# Altium project Yukitora.PrjPcb (part 5 of 5)

## Sheet ZPZH.SchDoc
size OrCAD A; Organization: Altium Limited; Address1: L3, 12a Rodborough Rd; Address2: Frenchs Forest; Address3: NSW; Address4: Australia 2086
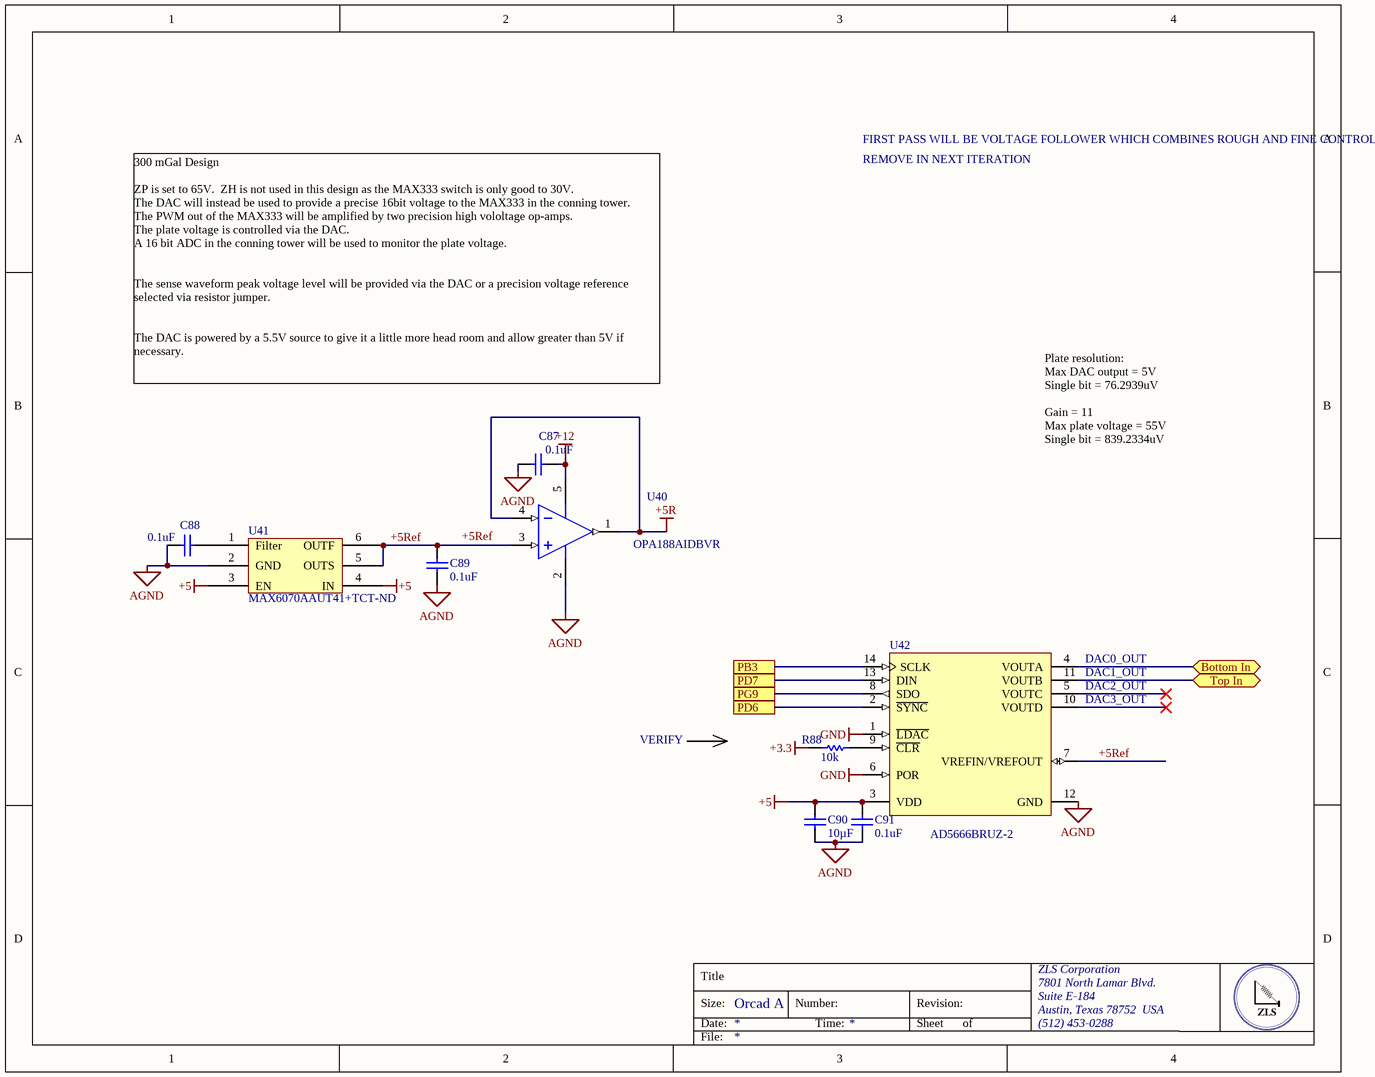
[diagram p12: ZPZH.SchDoc]

### Parts
C87  0.1uF  [CAPC0402(1005)60_L]
C88  0.1uF  [CAPC0402(1005)60_L]
C89  0.1uF  [CAPC0402(1005)60_L]
C90  Capacitance: 10µF  [CAPC0805(2012)145_N]  (hidden comment: 10uF)
C91  0.1uF  [CAPC0402(1005)60_L]
R88  10k  [RESC0402(1005)_M]
U40  OPA188AIDBVR  [DBV0005A_M]
U41  Supplier Part Number 1: MAX6070AAUT41+TCT-ND  [SOT95P280X445-6N]  (hidden comment: MAX6070AAUT41+T)
U42  AD5666BRUZ-2  [RU-14_N]

### Ports
Bottom In (bidir), PB3, PD6, PD7, PG9, Top In (bidir)

### Nets
+3.3: R88.1
+5: C90.2 C91.1 U41.3(EN) U41.4(IN) U42.3(VDD)
+5R: U40.1(OUT) U40.4(IN-)
+12: C87.1 U40.5(V+)
AGND: C87.2 C88.2 C89.1 C90.1 C91.2 U40.2(V-) U41.2(GND) U42.12(GND)
GND: U42.1(~{LDAC}) U42.6(POR)
+5Ref: C89.2 U40.3(IN+) U41.5(OUTS) U41.6(OUTF) U42.7(VREFIN/VREFOUT)
Bottom In: U42.4(VOUTA) ; port Bottom In
PB3: U42.14(SCLK) ; port PB3
PD6: U42.2(~{SYNC}) ; port PD6
PD7: U42.13(DIN) ; port PD7
PG9: U42.8(SDO) ; port PG9
Top In: U42.11(VOUTB) ; port Top In
NetC88_1: C88.1 U41.1(Filter)
NetR88_2: R88.2 U42.9(~{CLR})

Not connected (* = marked no-connect by the designer): U42 5(VOUTC)* 10(VOUTD)*

### Notes on the sheet
- FIRST PASS WILL BE VOLTAGE FOLLOWER WHICH COMBINES ROUGH AND FINE CONTROL
- REMOVE IN NEXT ITERATION
- 300 mGal Design
  ZP is set to 65V.  ZH is not used in this design as the MAX333 switch is only good to 30V.
  The DAC will instead be used to provide a precise 16bit voltage to the MAX333 in the conning tower.
  The PWM out of the MAX333 will be amplified by two precision high vololtage op-amps.
  The plate voltage is controlled via the DAC.
  A 16 bit ADC in the conning tower will be used to monitor the plate voltage.
  The sense waveform peak voltage level will be provided via the DAC or a precision voltage reference selected via resistor jumper.
  The DAC is powered by a 5.5V source to give it a little more head room and allow greater than 5V if necessary.
- Plate resolution:
  Max DAC output = 5V
  Single bit = 76.2939uV
  Gain = 11
  Max plate voltage = 55V
  Single bit = 839.2334uV
- (near U42) DAC0_OUT
- (near U42) DAC1_OUT
- (near U42) DAC2_OUT
- VERIFY
- (near U42) DAC3_OUT
- Labels drawn without touching a wire or pin: +5Ref
- Title
- Size:
- Date:
- Orcad A
- Number:
- Time:
- Revision:
- Sheet
- of
- ZLS Corporation
- 7801 North Lamar Blvd.
- Suite E-184
- Austin, Texas 78752  USA
- (512) 453-0288
- File:

### Library data of the parts
C87-C89 C91 = CMP-1034-00252-1: CAP CER 0.1UF 10V X7R 0402; Manufacturer: Murata Electronics North America; Manufacturer Part Number: GRM155R71A104KA01D; Tolerance: ±10%; Supplier 1: Digi-Key; Supplier Part Number 1: 490-6321-1-ND; RoHS: RoHS Compliant; Category: Capacitors; Stock 1: 2920395; Pricing 1: 1=0.1, 10=0.014, 100=0.0063, 500=0.00446, 1000=0.00351, 2500=0.00319, 5000=0.00293 (USD); Packaging: Cut Tape (CT); Part Status: Active; Voltage - Rated: 10V; Temperature Coefficient: X7R; Operating Temperature: -55°C ~ 125°C; Features: -; Ratings: -; Applications: General Purpose; Mounting Type: Surface Mount, MLCC; Package / Case: 0402 (1005 Metric); Size / Dimension: 0.039" L x 0.020" W (1.00mm x 0.50mm); Height - Seated (Max): -; Thickness (Max): 0.022" (0.55mm); Lead Spacing: -; ComponentLink1URL: http://www.murata.com/~/media/webrenewal/support/library/catalog/products/capacitor/mlcc/c02e.ashx?la=en-us; ComponentLink1Description: http://www.murata.com/~/media/webrenewal/support/library/catalog/products/capacitor/mlcc/c02e.ashx?la=en-us
C90 = CMP-1036-04795-1: CAP CER 10UF 25V X7R 0805; Manufacturer: Murata Electronics North America; Manufacturer Part Number: GRM21BR71E104KA01L; Tolerance: ±10%; Supplier 1: Digi-Key; Supplier Part Number 1: 490-1673-6-ND; RoHS: RoHS Compliant; Category: Capacitors; Stock 1: 891652; Pricing 1: 1=0.2, 10=0.145, 100=0.0683, 500=0.04788, 1000=0.03964 (USD); Packaging: Digi-Reel®; Part Status: Active; Voltage - Rated: 25V; Temperature Coefficient: X7R; Operating Temperature: -55°C ~ 125°C; Features: -; Ratings: -; Applications: General Purpose; Mounting Type: Surface Mount, MLCC; Package / Case: 0805 (2012 Metric); Size / Dimension: 0.079" L x 0.049" W (2.00mm x 1.25mm); Height - Seated (Max): -; Thickness (Max): 0.053" (1.35mm); Lead Spacing: -; Lead Style: -; ComponentLink1URL: http://www.murata.com/~/media/webrenewal/support/library/catalog/products/capacitor/mlcc/c02e.ashx; ComponentLink1Description: http://www.murata.com/~/media/webrenewal/support/library/catalog/products/capacitor/mlcc/c02e.ashx
R88 = CMP-1011-00940-1: 10k 0.063W 1% 0402 (1005 Metric)  SMD; Manufacturer: Panasonic; Manufacturer Part Number: ERJ-2RKF1002X; Resistance: 10kR; Temperature Coefficient: 100ppm/°C; Power Rating: 100mW; Voltage Rating: 50V; Supplier 1: Digi-Key; Supplier Part Number 1: P10.0KLDKR-ND; Stock 1: 12501303; Pricing 1: 1=0.10000, 10=0.04500, 100=0.01830, 1000=0.00823, 2500=0.00715, 5000=0.00590 (USD); RoHS: Yes; Mount: Surface Mount; Case/Package: 0402; Number of Pins: 2; Case Code (Metric): 1005; Case Code (Imperial): 0402; Contact Plating: Tin; Min Operating Temperature: -55°C; Max Operating Temperature: 155°C; Tolerance: 1%; Packaging: Tape and Reel; Composition: Thick Film; Termination: SMD/SMT; Voltage Rating (DC): 50V; Package Quantity: 1; Number of Terminations: 2; Max Power Dissipation: 100mW; Military Standard: Not; Features: Automotive AEC-Q200; Length: 1mm; Height: 0.35mm; Width: 0.02inch; Depth: 0.5mm; Radiation Hardening: No; Lead Free: Lead Free; REACH SVHC: No SVHC; ComponentLink1URL: https://datasheet.ciiva.com/11821/0900766b80f80784-11821171.pdf?src-supplier=RSComponents; ComponentLink1Description: https://datasheet.ciiva.com/11821/0900766b80f80784-11821171.pdf?src-supplier=RSComponents; ComponentLink2URL: https://datasheet.ciiva.com/16199/aoa0000ce2-16199478.pdf?src-supplier=Future+Electronics; ComponentLink2Description: https://datasheet.ciiva.com/16199/aoa0000ce2-16199478.pdf?src-supplier=Future+Electronics; ComponentLink3URL: https://datasheet.ciiva.com/17212/aoa0000ce2-17212102.pdf?src-supplier=Avnet+Europe; ComponentLink3Description: https://datasheet.ciiva.com/17212/aoa0000ce2-17212102.pdf?src-supplier=Avnet+Europe; ComponentLink4URL: https://datasheet.ciiva.com/24023/aoa0000ce2-24023017.pdf?src-supplier=Mouser; ComponentLink4Description: https://datasheet.ciiva.com/24023/aoa0000ce2-24023017.pdf?src-supplier=Mouser; ComponentLink5URL: https://datasheet.ciiva.com/28514/1678782-28514185.pdf?src-supplier=Element14; ComponentLink5Description: https://datasheet.ciiva.com/28514/1678782-28514185.pdf?src-supplier=Element14; ComponentLink6URL: https://datasheet.ciiva.com/43467/1678782-43467402.pdf?src-supplier=Farnell; ComponentLink6Description: https://datasheet.ciiva.com/43467/1678782-43467402.pdf?src-supplier=Farnell; ComponentLink7URL: https://datasheet.ciiva.com/27055/1987020-27055643.pdf?src-supplier=Jameco; ComponentLink7Description: https://datasheet.ciiva.com/27055/1987020-27055643.pdf?src-supplier=Jameco; ComponentLink8URL: https://datasheet.ciiva.com/48531/aoa0000ce2-48531069.pdf?src-supplier=Avnet; ComponentLink8Description: https://datasheet.ciiva.com/48531/aoa0000ce2-48531069.pdf?src-supplier=Avnet; ComponentLink9URL: https://datasheet.ciiva.com/9194/aoa0000ce2-9194142.pdf?src-supplier=Avnet; ComponentLink9Description: https://datasheet.ciiva.com/9194/aoa0000ce2-9194142.pdf?src-supplier=Avnet; ComponentLink10URL: https://datasheet.ciiva.com/16782/70260748-16782590.pdf?src-supplier=Allied+Electronics; ComponentLink10Description: https://datasheet.ciiva.com/16782/70260748-16782590.pdf?src-supplier=Allied+Electronics; ComponentLink11URL: https://datasheet.ciiva.com/16786/70260748-16786734.pdf?src-supplier=Allied+Electronics; ComponentLink11Description: https://datasheet.ciiva.com/16786/70260748-16786734.pdf?src-supplier=Allied+Electronics; ComponentLink12URL: https://datasheet.ciiva.com/30201/aoa0000ce2-30201022.pdf?src-supplier=Onlinecomponents.com; ComponentLink12Description: https://datasheet.ciiva.com/30201/aoa0000ce2-30201022.pdf?src-supplier=Onlinecomponents.com
U40 = CMP-0809-00005-2: Precision, Low Noise, Rail-to-Rail Output, Zero-Drift Operational Amplifier, 4 to 36 V, -40 to 125 degC, 5-pin SOT23 (DBV5), Green (RoHS & no Sb/Br); Manufacturer: Texas Instruments; Total Supply Voltage(Min)(+5V is 5, +/-5V is 10): 4; Offset Drift(Typ)(uV/C): 0.03; Rating: Catalog; SubFamily: Zero Drift Precision Amplifier; GBW(Typ)(MHz): 2; Slew Rate(Typ)(V/us): 0.8; Number of Channels: 1; CMRR(Min)(dB): 120; Iq per channel(Max)(mA): 0.51; Total Supply Voltage(Max)(+5V is 5, +/-5V is 10): 36; Unity Gain Bandwidth Product: 2MHz; Max Supply Voltage: 36V; Min Supply Voltage: 4V; Min Dual Supply Voltage: 2V; Max Dual Supply Voltage: 18V; Nominal Supply Current: 510uA; Common Mode Rejection Ratio: 120dB; Slew Rate: 0.8V/µs; Input Bias Current: 160pA; Input Offset Voltage (Vos): 6uV; Operating Supply Current: 450uA; Output Current per Channel: 18mA; Voltage Gain: 136dB; Input Voltage Noise Density: 8.8nV/sqrt Hz; Power Supply Rejection Ratio (PSRR): 142dB; PartNumber: OPA188AIDBVR; ComponentLink2Description: Datasheet; ComponentLink2URL: http://www.ti.com/lit/ds/symlink/opa188.pdf; ComponentLink1Description: Manufacturer URL; Mounting Technology: Surface Mount; Eco-Plan: Green (RoHS & no Sb/Br); ComponentLink1URL: http://www.ti.com/; PackageVersion: 4073253-4/K, 03/2006; DatasheetVersion: SBOS642A; ComponentLink3Description: Package Specification; PackageReference: DBV0005A; ComponentLink3URL: http://www.ti.com/litv/pdf/mpds018i; PackageDescription: 5-Pin Plastic Small Outline, Body 1.6 x 2.9 mm, Pitch 0.95 mm; Code_JEDEC: MO-178; Supplier 1: Arrow; Supplier Part Number 1: OPA188AIDBVR; Manufacturer Part Number: OPA188AIDBVR; Stock 1: 838; Pricing 1: 1=2.2115, 10=1.9133, 25=1.722, 100=1.5598, 250=1.5572, 500=1.3341 (USD); Case/Package: SOT-23-5; Number of Pins: 5; Contact Plating: Gold; Min Operating Temperature: -40°C; Max Operating Temperature: 125°C; Packaging: Tape and Reel; Package Quantity: 3000; Nominal Gain Bandwidth Product: 2MHz; Number of Circuits: 1; Gain Bandwidth Product: 2MHz; Number of Elements: 1; Lead Free: Lead Free; ComponentLink4URL: http://www.ti.com/lit/gpn/opa188?src-supplier=Mouser; ComponentLink4Description: http://www.ti.com/lit/gpn/opa188?src-supplier=Mouser; ComponentLink5URL: http://www.ti.com/lit/ds/symlink/opa188.pdf?src-supplier=Digi-Key; ComponentLink5Description: http://www.ti.com/lit/ds/symlink/opa188.pdf?src-supplier=Digi-Key
U41 = MAX6070AAUT41+T: IC VREF SERIES 4.096V SOT23; Manufacturer: Maxim Integrated; Output Type: Fixed; Tolerance: ±0.04%; Temperature Coefficient: 6ppm/°C; Noise - 0.1Hz to 10Hz: 9.6µVp-p; Noise - 10Hz to 10kHz: 9µVrms; Voltage - Input: 4.3 V ~ 5.5 V; Current - Supply: 350µA; Supplier 1: Digi-Key; Manufacturer Part Number: MAX6070AAUT41+T; RoHS: RoHS Compliant; Category: Integrated Circuits (ICs); Stock 1: 2623; Pricing 1: 1=3.41, 10=3.213, 25=2.5704, 50=2.4418, 100=2.2491, 250=2.13344, 500=2.05634 (USD); Packaging: Cut Tape (CT); Part Status: Active; Reference Type: Series; Voltage - Output (Min/Fixed): 4.096V; Operating Temperature: -40°C ~ 125°C (TA); Mounting Type: Surface Mount; Package / Case: SOT-23-6; Supplier Device Package: SOT-23-6; ComponentLink1URL: https://datasheets.maximintegrated.com/en/ds/MAX6070-MAX6071.pdf; ComponentLink1Description: https://datasheets.maximintegrated.com/en/ds/MAX6070-MAX6071.pdf
U42 = CMP-0318-01541-2: Quad 16-Bit Digital-to-Analog Converter with 5 ppm/degC On-Chip Reference, -40 to +105 degC, RU-14, Pb-Free, Tube; Generic Part Number: AD5666; Manufacturer: Analog Devices; Max V+: 5.5V; Op Pwr Diss: 12.5mW; Settling Time: 6Âµs; Resolution (Bits): 16; Single Supply: Yes; # DAC Outputs: 4; Resolution: 16b; Conversion Rate: 95KS/s; Integral Nonlinearity (INL): 16LSB; Output Type: Voltage; Interface: SPI,Serial; Min Supply Voltage: 2.7V; Slew Rate: 1.5V/µs; Differential Output: No; Power Dissipation: 8.8mW; Polarity: Unipolar; Min Input Voltage: 0uV; Nominal Supply Current: 1.3mA; Mounting Technology: Surface Mount; ComponentLink3URL: http://www.analog.com/static/imported-files/packages/36057385283879153717235186773RU14.pdf; ComponentLink2Description: Datasheet; Packing: Tube; PackageVersion: Aug-2002; ComponentLink4Description: Product URL; ComponentLink1Description: Manufacturer URL; PartNumber: AD5666BRUZ-2; PackageReference: RU-14; Code_JEDEC: MO-153-AB-1; ComponentLink2URL: http://www.analog.com/static/imported-files/data_sheets/AD5666.pdf; ComponentLink4URL: http://www.analog.com/en/digital-to-analog-converters/da-converters/ad5666/products/product.html; PackageDescription: 14-Lead Thin Shrink Small Outline Package [TSSOP]; DatasheetVersion: Rev.D; RoHS: Y; ComponentLink1URL: http://www.analog.com/en/index.html; ComponentLink3Description: Package Specification; RevisionNote: Component URL fixed; Supplier 1: Arrow; Supplier Part Number 1: AD5666BRUZ-2; Manufacturer Part Number: AD5666BRUZ-2; Stock 1: 85; Pricing 1: 1=18.32, 10=16.76, 25=15.54, 50=15.29, 100=13.33, 250=12.86, 500=12.13, 1000=12.09 (USD); Case/Package: SOP; Number of Pins: 14; Contact Plating: Tin,Matte; Min Operating Temperature: -40°C; Max Operating Temperature: 105°C; Package Quantity: 1; Number of Channels: 4; Max Supply Voltage: 5.5V; Number of DAC Channels: 4; Max Power Dissipation: 12.5mW; Packaging: Rail/Tube; Number of Bits: 16; Number of D/A Converters: 4; Number of Converters: 4; Sampling Rate: 95KS/s; Max Input Voltage: 5.5V; Max Output Voltage: 5.5V; Min Output Voltage: 0uV; Termination: SMD/SMT; Length: 5.1mm; Height: 1.05mm; Width: 4.5mm; Radiation Hardening: No; Lead Free: Contains Lead; REACH SVHC: No SVHC; ComponentLink5URL: http://www.analog.com/media/en/technical-documentation/data-sheets/AD5666.pdf?src-supplier=Digi-Key; ComponentLink5Description: http://www.analog.com/media/en/technical-documentation/data-sheets/AD5666.pdf?src-supplier=Digi-Key; ComponentLink6URL: http://www.analog.com/static/imported-files/data_sheets/AD5666.pdf?src-supplier=Avnet; ComponentLink6Description: http://www.analog.com/static/imported-files/data_sheets/AD5666.pdf?src-supplier=Avnet; ComponentLink7URL: http://www.analog.com/static/imported-files/data_sheets/AD5666.pdf?src-supplier=Avnet+Europe; ComponentLink7Description: http://www.analog.com/static/imported-files/data_sheets/AD5666.pdf?src-supplier=Avnet+Europe; ComponentLink8URL: http://www.farnell.com/datasheets/1610743.pdf?src-supplier=Element14; ComponentLink8Description: http://www.farnell.com/datasheets/1610743.pdf?src-supplier=Element14; ComponentLink9URL: http://datasheet.iiic.cc/analog_devices/AD5666BRUZ-2.pdf?src-supplier=IIIC; ComponentLink9Description: http://datasheet.iiic.cc/analog_devices/AD5666BRUZ-2.pdf?src-supplier=IIIC

## Sheet Encoder.SchDoc
size Tabloid; Organization: Altium Limited; Address1: L3, 12a Rodborough Rd; Address2: Frenchs Forest; Address3: NSW; Address4: Australia 2086
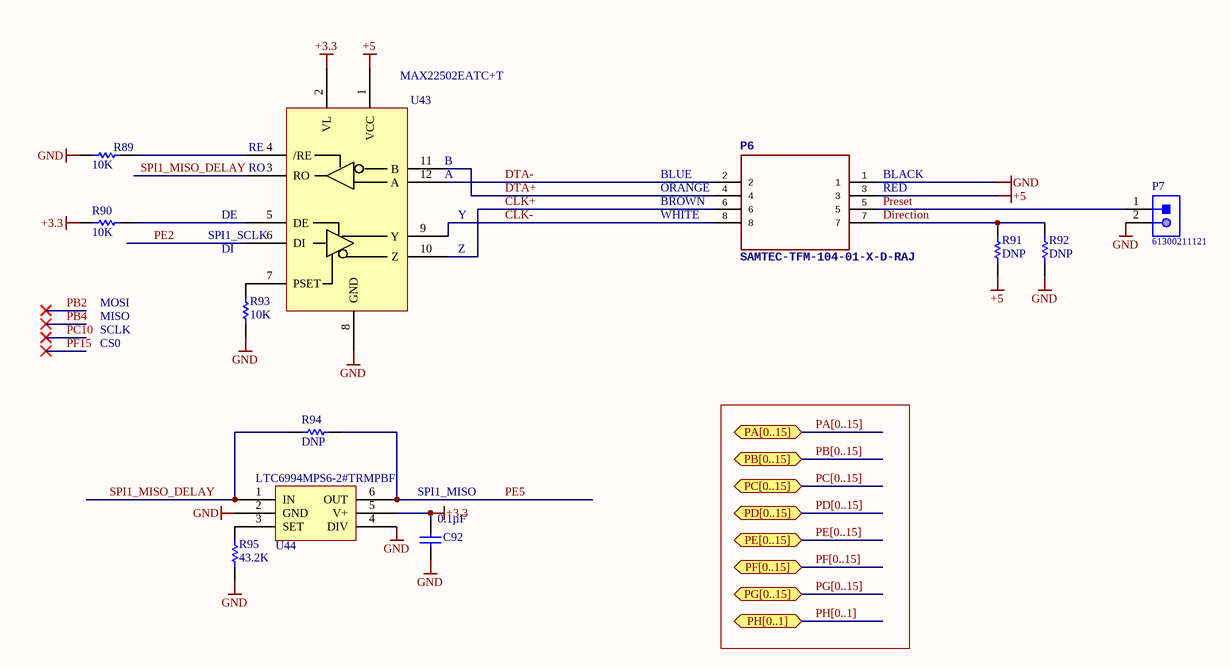
[diagram p13: Encoder.SchDoc]

### Parts
C92  Capacitance: 0.1µF  [CAPC0805(2012)145_N]  (hidden comment: CAP CER 0.1UF 25V X7R 0805)
P6  SAMTEC-TFM-104-01-X-D-RAJ  [SAMTEC-TFM-104-01-X-D-RA]
P7  61300211121  [61300211121]
R89  10K  [RESC0805(2012)_L]
R90  10K  [RESC0805(2012)_L]
R91  DNP  [RESC0805(2012)_L]
R92  DNP  [RESC0805(2012)_L]
R93  10K  [RESC0805(2012)_L]
R94  DNP  [RESC0805(2012)_L]
R95  43.2K  [RESC0805(2012)_L]
U43  MAX22502EATC+T  [MAX22502EATC+T]
U44  LTC6994MPS6-2#TRMPBF  [LTC6994MPS6-2#TRMPBF]

### Ports
PA[0..15] (bidir), PB[0..15] (bidir), PC[0..15] (bidir), PD[0..15] (bidir), PE[0..15] (bidir), PF[0..15] (bidir), PG[0..15] (bidir), PH[0..1] (bidir)

### Nets
+3.3: C92.1 R90.2 U43.2(VL) U44.5(V+)
+5: P6.3 R91.1 U43.1(VCC)
GND: C92.2 P6.1 P7.2 R89.2 R92.1 R93.2 R95.2 U43.8(GND) U44.2(GND) U44.4(DIV)
CLK+: P6.6 U43.10(Z)
CLK-: P6.8 U43.9(Y)
Direction: P6.7 R91.2 R92.2
DTA+: P6.4 U43.11(B)
DTA-: P6.2 U43.12(A)
PE2: U43.6(DI)
PE5: R94.2 U44.6(OUT)
Preset: P6.5 P7.1
SPI1_MISO_DELAY: R94.1 U43.3(RO) U44.1(IN)
NetR89_1: R89.1 U43.4(/RE)
NetR90_1: R90.1 U43.5(DE)
NetR93_1: R93.1 U43.7(PSET)
NetR95_1: R95.1 U44.3(SET)

### Buses and harness runs
bus PA[0..15] = port PA[0..15]
bus PB[0..15] = port PB[0..15]
bus PC[0..15] = port PC[0..15]
bus PD[0..15] = port PD[0..15]
bus PE[0..15] = port PE[0..15]
bus PF[0..15] = port PF[0..15]
bus PG[0..15] = port PG[0..15]
bus PH[0..1] = port PH[0..1]

### Notes on the sheet
- (near U43) RO
- (near U43) RE
- (near U43) B
- (near U43) A
- BLUE
- (near P6) BLACK
- (near U43) SPI1_SCLK
- DE
- (near U43) Y
- (near P6) BROWN
- (near P6) WHITE
- (near P6) ORANGE
- (near P6) RED
- MOSI
- DI
- (near U43) Z
- MISO
- SCLK
- CS0
- (near C92) SPI1_MISO
- Title
- Size:
- Date:
- Tabloid
- Number:
- Time:
- Revision:
- Sheet
- of
- File:

### Library data of the parts
C92 = CMP-1036-04795-1: Manufacturer: Murata Electronics North America; Manufacturer Part Number: GRM21BR71E104KA01L; Tolerance: ±10%; Supplier 1: Digi-Key; Supplier Part Number 1: 490-1673-6-ND; RoHS: RoHS Compliant; Category: Capacitors; Stock 1: 891652; Pricing 1: 1=0.2, 10=0.145, 100=0.0683, 500=0.04788, 1000=0.03964 (USD); Packaging: Digi-Reel®; Part Status: Active; Voltage - Rated: 25V; Temperature Coefficient: X7R; Operating Temperature: -55°C ~ 125°C; Features: -; Ratings: -; Applications: General Purpose; Mounting Type: Surface Mount, MLCC; Package / Case: 0805 (2012 Metric); Size / Dimension: 0.079" L x 0.049" W (2.00mm x 1.25mm); Height - Seated (Max): -; Thickness (Max): 0.053" (1.35mm); Lead Spacing: -; Lead Style: -; ComponentLink1URL: http://www.murata.com/~/media/webrenewal/support/library/catalog/products/capacitor/mlcc/c02e.ashx; ComponentLink1Description: http://www.murata.com/~/media/webrenewal/support/library/catalog/products/capacitor/mlcc/c02e.ashx
P7 = CMP-1502-01060-1: THT Vertical Pin Header WR-PHD, Pitch 2.54 mm, Single Row, 2 pins; Manufacturer: Wurth Elektronik; Rated Current: 3A; Gender: Male; Withstanding Voltage: 500VAC; Working Voltage: 250VAC; Pitch: 2.54mm; Contact Resistance: 20mOhm; Pin Number: 2; Mounting Technology: THT; Orientation: Vertical; Operating Temperature: -40to105degC; Packaging: Bag; Publisher: WurthElektronik; Datasheet URL: https://katalog.we-online.de/em/datasheet/6130xx11121.pdf; Manufacturer URL: http://www.we-online.de; Row Number: Single; Package Reference: 61300211121; Part Number: 61300211121
R89 R90 R93 = CMP-1013-00215-1: RES SMD 10K OHM 1% 1/8W 0805; Manufacturer: Vishay Dale; Manufacturer Part Number: CRCW080510K0FKEA; Power (Watts): 0.125W, 1/8W; Temperature Coefficient: ±100ppm/°C; Supplier 1: Digi-Key; Supplier Part Number 1: 541-10.0KCCT-ND; RoHS: RoHS Compliant; Category: Resistors; Stock 1: 1104982; Pricing 1: 1=0.1, 10=0.055, 100=0.0223, 1000=0.01003, 2500=0.0087 (USD); Packaging: Cut Tape (CT); Part Status: Active; Tolerance: ±1%; Composition: Thick Film; Features: Automotive AEC-Q200; Operating Temperature: -55°C ~ 155°C; Package / Case: 0805 (2012 Metric); Supplier Device Package: 0805; Size / Dimension: 0.079" L x 0.049" W (2.00mm x 1.25mm); Height - Seated (Max): 0.020" (0.50mm); Failure Rate: -; ComponentLink1URL: http://www.vishay.com/docs/20035/dcrcwe3.pdf; ComponentLink1Description: http://www.vishay.com/docs/20035/dcrcwe3.pdf
R91 R92 R94 = CMP-1013-00215-1: RES SMD 0 OHM 5% 1/8W 0805
R95 = CMP-1013-00215-1: RES SMD 43.2K OHM 1% 1/8W 0805; Manufacturer: Vishay Dale; Manufacturer Part Number: CRCW080543K2FKEA; Power (Watts): 0.125W, 1/8W; Temperature Coefficient: ±100ppm/°C; Supplier 1: Digi-Key; Supplier Part Number 1: 541-43.2KCCT-ND; RoHS: RoHS Compliant; Category: Resistors; Stock 1: 68577; Pricing 1: 1=0.1, 10=0.055, 100=0.0223, 1000=0.01003, 2500=0.0087 (USD); Packaging: Cut Tape (CT); Part Status: Active; Tolerance: ±1%; Composition: Thick Film; Features: Automotive AEC-Q200; Operating Temperature: -55°C ~ 155°C; Package / Case: 0805 (2012 Metric); Supplier Device Package: 0805; Size / Dimension: 0.079" L x 0.049" W (2.00mm x 1.25mm); Height - Seated (Max): 0.020" (0.50mm); Failure Rate: -; ComponentLink1URL: http://www.vishay.com/docs/20035/dcrcwe3.pdf; ComponentLink1Description: http://www.vishay.com/docs/20035/dcrcwe3.pdf
U44 = LTC6994MPS6-2#TRMPBF: Manufacturer: Linear Technology/Analog Devices; Manufacturer Part Number: LTC6994CS6-2#TRMPBF; Function: Programmable; Available Total Delays: 1µs ~ 33.6s; Voltage - Supply: 2.25 V ~ 5.5 V; Supplier 1: Digi-Key; Supplier Part Number 1: LTC6994CS6-2#TRMPBFCT-ND; RoHS: RoHS Compliant; Category: Integrated Circuits (ICs); Stock 1: 1401; Pricing 1: 1=3.42, 25=3.0496, 100=1.9217, 250=1.76156 (USD); Packaging: Cut Tape (CT); Part Status: Active; Delay to 1st Tap: -; Operating Temperature: 0°C ~ 70°C; Mounting Type: Surface Mount; Package / Case: SOT-23-6 Thin, TSOT-23-6; Supplier Device Package: TSOT-23-6; Base Part Number: LTC6994; ComponentLink1URL: http://www.linear.com/docs/29725; ComponentLink1Description: http://www.linear.com/docs/29725

## Sheet Motors.SchDoc
size Tabloid; Organization: Altium Limited; Address1: L3, 12a Rodborough Rd; Address2: Frenchs Forest; Address3: NSW; Address4: Australia 2086
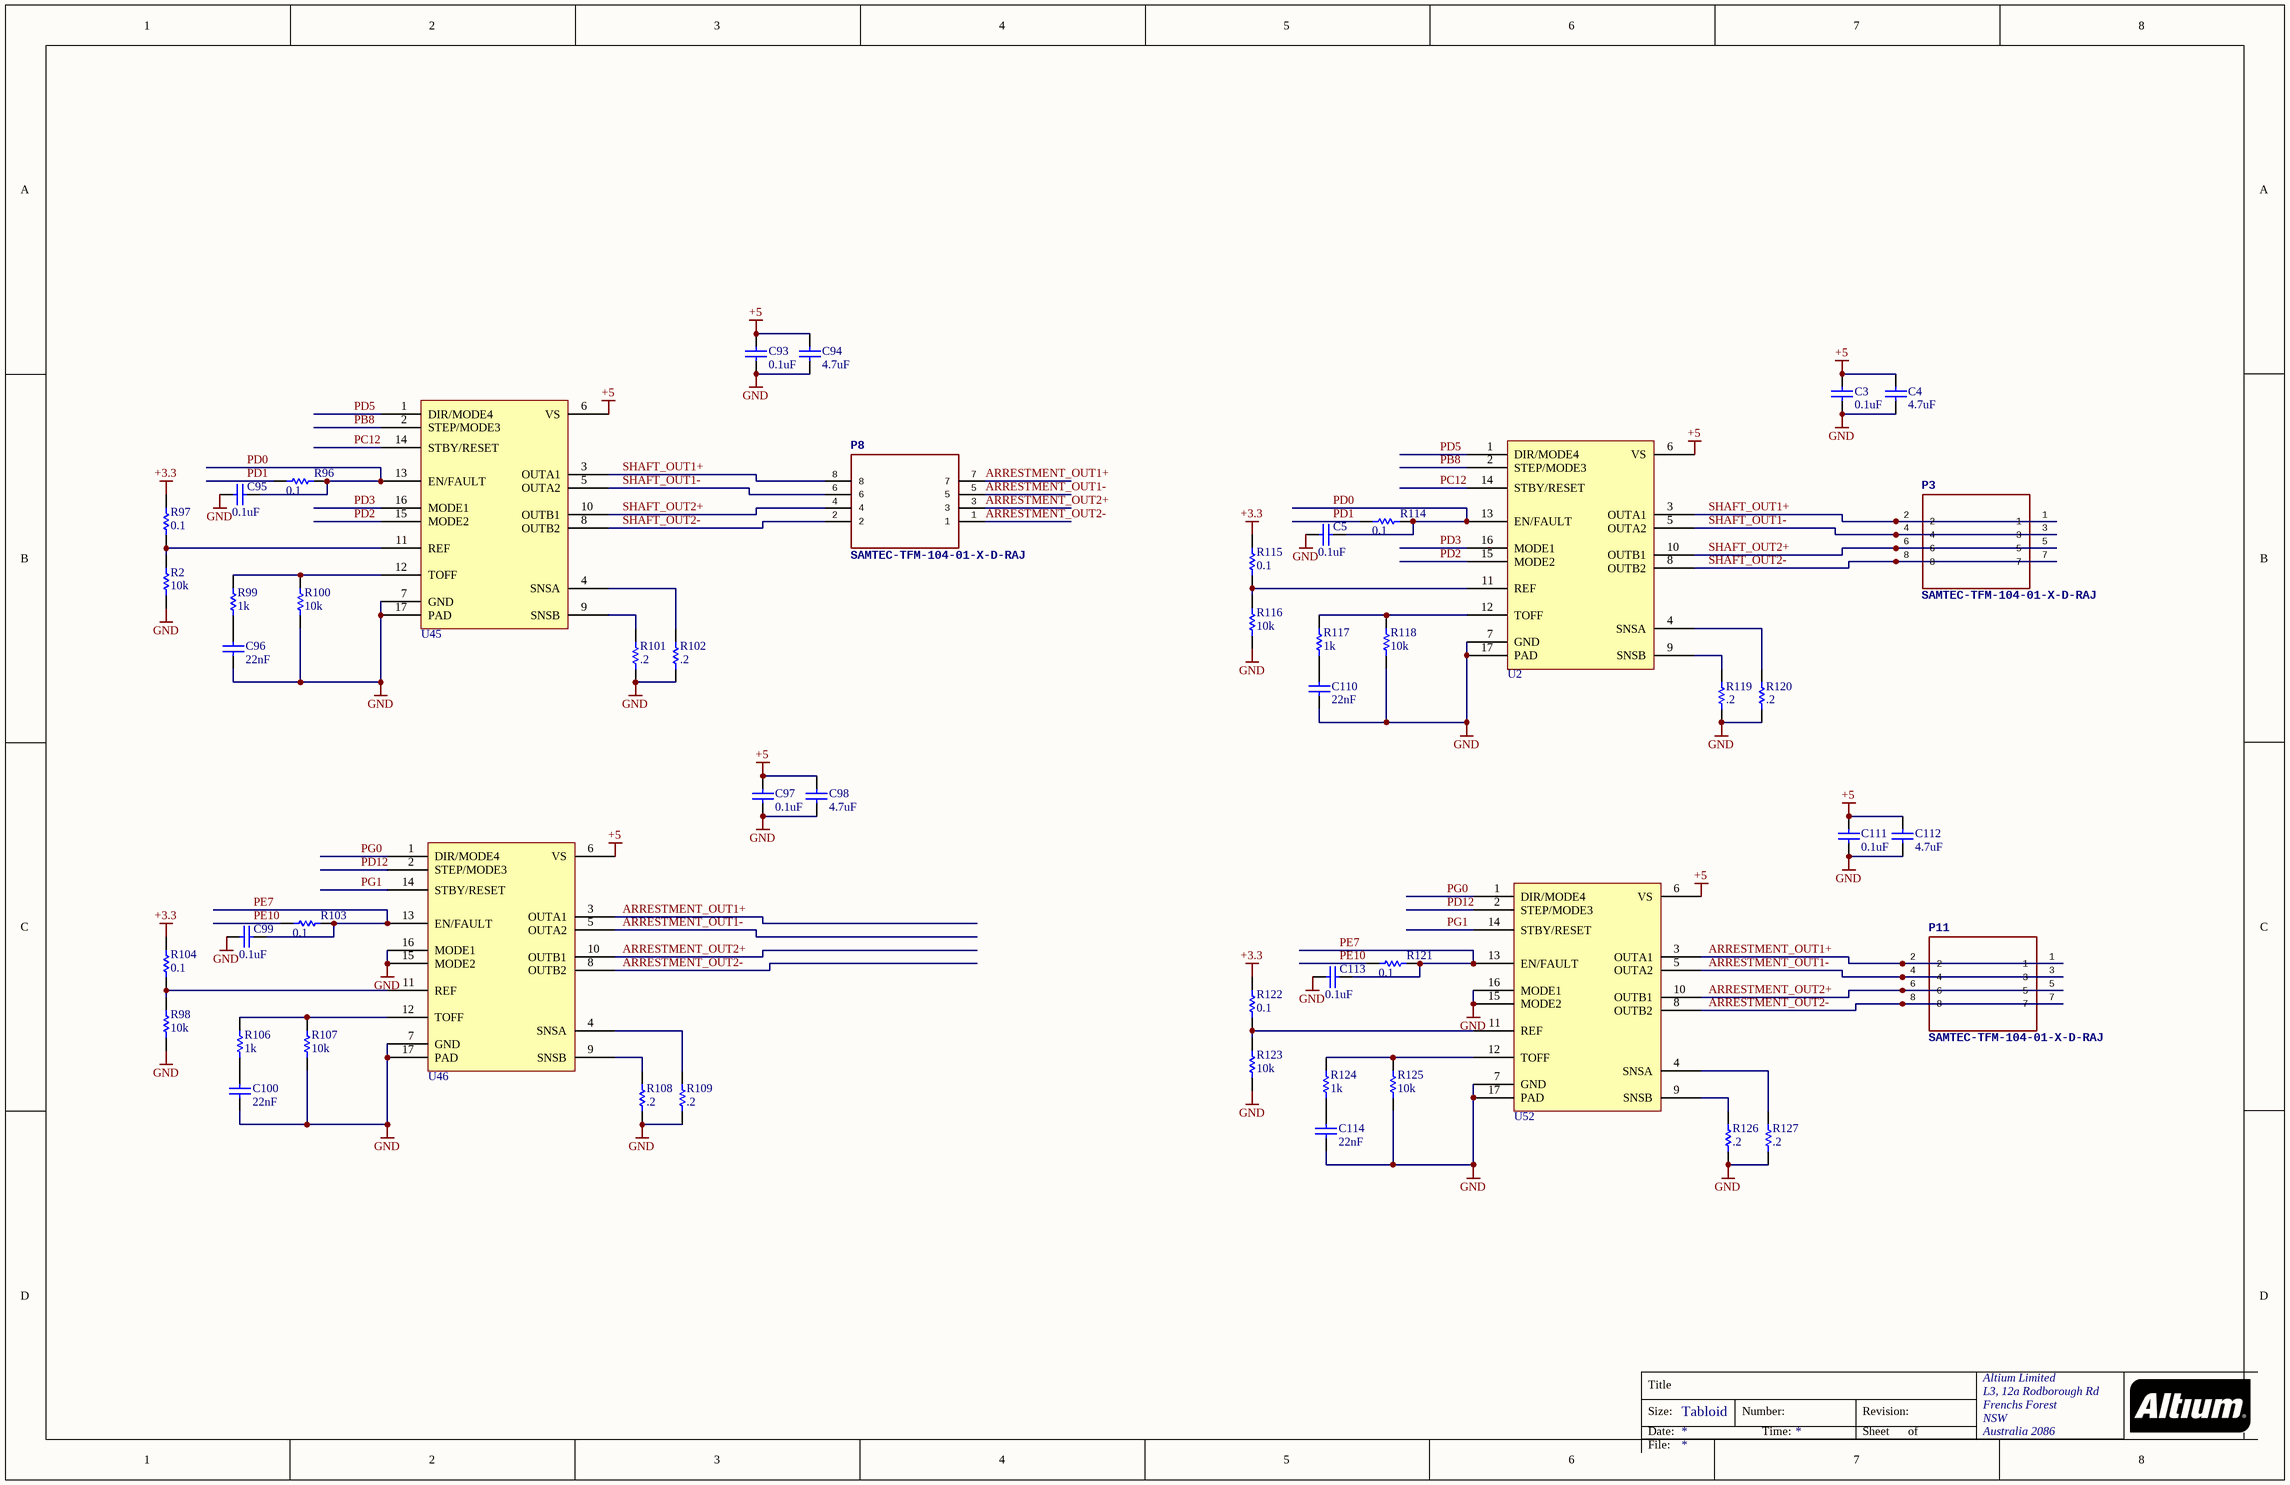
[diagram p14: Motors.SchDoc]

### Parts
C3  0.1uF  [CAPC1608X94X35LL15T15]
C4  4.7uF  [CAPC0603(1608)55_M]
C5  0.1uF  [CAPC1608X94X35LL15T15]
C93  0.1uF  [CAPC1608X94X35LL15T15]
C94  4.7uF  [CAPC0603(1608)55_M]
C95  0.1uF  [CAPC1608X94X35LL15T15]
C96  22nF  [CAPC1608X94X35LL15T15]
C97  0.1uF  [CAPC1608X94X35LL15T15]
C98  4.7uF  [CAPC0603(1608)55_M]
C99  0.1uF  [CAPC1608X94X35LL15T15]
C100  22nF  [CAPC1608X94X35LL15T15]
C110  22nF  [CAPC1608X94X35LL15T15]
C111  0.1uF  [CAPC1608X94X35LL15T15]
C112  4.7uF  [CAPC0603(1608)55_M]
C113  0.1uF  [CAPC1608X94X35LL15T15]
C114  22nF  [CAPC1608X94X35LL15T15]
P3  SAMTEC-TFM-104-01-X-D-RAJ  [SAMTEC-TFM-104-01-X-D-RA]
P8  SAMTEC-TFM-104-01-X-D-RAJ  [SAMTEC-TFM-104-01-X-D-RA]
P11  SAMTEC-TFM-104-01-X-D-RAJ  [SAMTEC-TFM-104-01-X-D-RA]
R2  10k  [RESC0603(1608)_N]
R96  0.1  [RESC0603(1608)_N]
R97  0.1  [RESC0603(1608)_N]
R98  10k  [RESC0603(1608)_N]
R99  1k  [RESC0603(1608)_N]
R100  10k  [RESC0603(1608)_N]
R101  .2  [RESC0603(1608)_N]
R102  .2  [RESC0603(1608)_N]
R103  0.1  [RESC0603(1608)_N]
R104  0.1  [RESC0603(1608)_N]
R106  1k  [RESC0603(1608)_N]
R107  10k  [RESC0603(1608)_N]
R108  .2  [RESC0603(1608)_N]
R109  .2  [RESC0603(1608)_N]
R114  0.1  [RESC0603(1608)_N]
R115  0.1  [RESC0603(1608)_N]
R116  10k  [RESC0603(1608)_N]
R117  1k  [RESC0603(1608)_N]
R118  10k  [RESC0603(1608)_N]
R119  .2  [RESC0603(1608)_N]
R120  .2  [RESC0603(1608)_N]
R121  0.1  [RESC0603(1608)_N]
R122  0.1  [RESC0603(1608)_N]
R123  10k  [RESC0603(1608)_N]
R124  1k  [RESC0603(1608)_N]
R125  10k  [RESC0603(1608)_N]
R126  .2  [RESC0603(1608)_N]
R127  .2  [RESC0603(1608)_N]
U2  STSPIN220  [STSPIN220-QFN127P600-8N]  (value not drawn)
U45  STSPIN220  [STSPIN220-QFN127P600-8N]  (value not drawn)
U46  STSPIN220  [STSPIN220-QFN127P600-8N]  (value not drawn)
U52  STSPIN220  [STSPIN220-QFN127P600-8N]  (value not drawn)

### Nets
+3.3: R97.2 R104.2 R115.2 R122.2
+5: C3.1 C4.2 C93.1 C94.2 C97.1 C98.2 C111.1 C112.2 U2.6(VS) U45.6(VS) U46.6(VS) U52.6(VS)
GND: C3.2 C4.1 C5.1 C93.2 C94.1 C95.1 C96.2 C97.2 C98.1 C99.1 C100.2 C110.2 C111.2 C112.1 C113.1 C114.2 R2.1 R98.1 R100.1 R101.1 R102.1 R107.1 R108.1 R109.1 R116.1 R118.1 R119.1 R120.1 R123.1 R125.1 R126.1 R127.1 U2.7(GND) U2.17(PAD) U45.7(GND) U45.17(PAD) U46.7(GND) U46.15(MODE2) U46.16(MODE1) U46.17(PAD) U52.7(GND) U52.15(MODE2) U52.16(MODE1) U52.17(PAD)
ARRESTMENT_OUT1+: P8.7 P11.1 P11.2 U46.3(OUTA1) U52.3(OUTA1)
ARRESTMENT_OUT1-: P8.5 P11.3 P11.4 U46.5(OUTA2) U52.5(OUTA2)
ARRESTMENT_OUT2+: P8.3 P11.5 P11.6 U46.10(OUTB1) U52.10(OUTB1)
ARRESTMENT_OUT2-: P8.1 P11.7 P11.8 U46.8(OUTB2) U52.8(OUTB2)
PB8: U2.2(STEP/MODE3) U45.2(STEP/MODE3)
PC12: U2.14(STBY/RESET) U45.14(STBY/RESET)
PD0: C5.2 C95.2 R96.1 R114.1 U2.13(EN/FAULT) U45.13(EN/FAULT)
PD1: R96.2 R114.2
PD2: U2.15(MODE2) U45.15(MODE2)
PD3: U2.16(MODE1) U45.16(MODE1)
PD5: U2.1(DIR/MODE4) U45.1(DIR/MODE4)
PD12: U46.2(STEP/MODE3) U52.2(STEP/MODE3)
PE7: C99.2 C113.2 R103.1 R121.1 U46.13(EN/FAULT) U52.13(EN/FAULT)
PE10: R103.2 R121.2
PG0: U46.1(DIR/MODE4) U52.1(DIR/MODE4)
PG1: U46.14(STBY/RESET) U52.14(STBY/RESET)
SHAFT_OUT1+: P3.1 P3.2 P8.8 U2.3(OUTA1) U45.3(OUTA1)
SHAFT_OUT1-: P3.3 P3.4 P8.6 U2.5(OUTA2) U45.5(OUTA2)
SHAFT_OUT2+: P3.5 P3.6 P8.4 U2.10(OUTB1) U45.10(OUTB1)
SHAFT_OUT2-: P3.7 P3.8 P8.2 U2.8(OUTB2) U45.8(OUTB2)
NetC96_1: C96.1 R99.1
NetC100_1: C100.1 R106.1
NetC110_1: C110.1 R117.1
NetC114_1: C114.1 R124.1
NetR2_2: R2.2 R97.1 U45.11(REF)
NetR98_2: R98.2 R104.1 U46.11(REF)
NetR99_2: R99.2 R100.2 U45.12(TOFF)
NetR101_2: R101.2 U45.9(SNSB)
NetR102_2: R102.2 U45.4(SNSA)
NetR106_2: R106.2 R107.2 U46.12(TOFF)
NetR108_2: R108.2 U46.9(SNSB)
NetR109_2: R109.2 U46.4(SNSA)
NetR115_1: R115.1 R116.2 U2.11(REF)
NetR117_2: R117.2 R118.2 U2.12(TOFF)
NetR119_2: R119.2 U2.9(SNSB)
NetR120_2: R120.2 U2.4(SNSA)
NetR122_1: R122.1 R123.2 U52.11(REF)
NetR124_2: R124.2 R125.2 U52.12(TOFF)
NetR126_2: R126.2 U52.9(SNSB)
NetR127_2: R127.2 U52.4(SNSA)

### Notes on the sheet
- Title
- Size:
- Date:
- Tabloid
- Number:
- Time:
- Revision:
- Sheet
- of
- File:

### Library data of the parts
C3 C5 C93 C95-C97 C99 C100 C110 C111 C113 C114 = CMP-1661-00001-2: CAP .1UF 16V CERAMIC X7R 0603; Manufacturer: Yageo; Manufacturer Part Number: CC0603KRX7R7BB105; Capacitance: 1uF; Tolerance: 10%; Dissipation Factor: 5%; ComponentLink1Description: Datasheet; ComponentLink1URL: http://datasheets.avx.com/X7RDielectric.pdf; Supplier 1: Digi-Key; Supplier Part Number 1: 311-1446-6-ND; Stock 1: 5506121; Pricing 1: 1=0.21, 10=0.143, 100=0.0727, 500=0.04974, 1000=0.044 (USD); Mount: Surface Mount; Case/Package: 0603; Number of Pins: 2; Case Code (Metric): 1608; Case Code (Imperial): 0603; Min Operating Temperature: -55°C; Max Operating Temperature: 125°C; Voltage Rating: 16V; Package Quantity: 1; Packaging: Tape and Reel; Voltage Rating (DC): 16V; Dielectric: X7R; Termination: SMD/SMT; Voltage: 16V; Composition: Ceramic; Length: 1.6mm; Height: 0.8mm; Width: 0.031inch; Thickness: 0.035inch; Depth: 0.8mm; Radiation Hardening: No; REACH SVHC: Unknown; Lead Free: Lead Free; Halogen Free: Halogen Free; ComponentLink2URL: http://www.yageo.com/documents/recent/UPY-GPHC_X7R_6.3V-to-50V_18.pdf; ComponentLink2Description: http://www.yageo.com/documents/recent/UPY-GPHC_X7R_6.3V-to-50V_18.pdf; ComponentLink3URL: http://www.yageo.com/documents/recent/UPY-GPHC_X7R_6.3V-to-50V_8.pdf; ComponentLink3Description: http://www.yageo.com/documents/recent/UPY-GPHC_X7R_6.3V-to-50V_8.pdf; ComponentLink4URL: http://www.farnell.com/datasheets/1734573.pdf; ComponentLink4Description: http://www.farnell.com/datasheets/1734573.pdf; ComponentLink5URL: http://www.farnell.com/datasheets/1489800.pdf; ComponentLink5Description: http://www.farnell.com/datasheets/1489800.pdf
C4 C94 C98 C112 = CMP-1035-02779-1: CAP 4.7uF 6.3V ±10% 0603 (1608 Metric) Thickness 0.55mm SMD; Manufacturer: KEMET; Manufacturer Part Number: C0603C475K9PACTU; Case-EIA: 0603; Tolerance: Â±10%; Case-Metric: 1608; Dielectric Material: Ceramic; Dielectric: X5R; Dissipation Factor: 5%; Technology: SMT; Value: 4.7uF; Max Thickness: 0.55 mm; Rated Voltage: 6.3 V; Supplier 1: Digi-Key; Supplier Part Number 1: 399-3482-6-ND; Stock 1: 1765509; Pricing 1: 1=0.21, 10=0.15, 100=0.0706, 500=0.04952, 1000=0.041 (USD); Mount: PCB,Surface Mount; Case/Package: 0603; Number of Pins: 2; Case Code (Metric): 1608; Case Code (Imperial): 0603; Contact Plating: Matte,Tin; Min Operating Temperature: -55°C; Max Operating Temperature: 85°C; Package Quantity: 1; Capacitance: 4.7uF; Voltage Rating: 6.3V; Packaging: Tape and Reel; Termination: SMD/SMT; Voltage Rating (DC): 6.3V; Voltage: 6.3V; Length: 1.6mm; Height: 0.8mm; Width: 0.031inch; Thickness: 0.035inch; Depth: 0.8mm; Lead Pitch: 0.7mm; Radiation Hardening: No; Lead Free: Lead Free; REACH SVHC: No SVHC; ComponentLink1URL: https://api.kemet.com/component-edge/download/datasheet/C0603C475K9PACTU.pdf; ComponentLink1Description: https://api.kemet.com/component-edge/download/datasheet/C0603C475K9PACTU.pdf; ComponentLink2URL: http://www.farnell.com/datasheets/1732700.pdf; ComponentLink2Description: http://www.farnell.com/datasheets/1732700.pdf; ComponentLink3URL: http://www.farnell.com/datasheets/1789732.pdf; ComponentLink3Description: http://www.farnell.com/datasheets/1789732.pdf; ComponentLink4URL: http://www.farnell.com/datasheets/40889.pdf; ComponentLink4Description: http://www.farnell.com/datasheets/40889.pdf
R2 R96-R104 R106-R109 R114-R127 = CMP-1012-00511-1: 0R12 0.1W 1% 0603 (1608 Metric)  SMD; Manufacturer: Vishay; Manufacturer Part Number: CRCW060310K0FKEA; Value: 1020.00 Ohm; Case-EIA: 0603; Case-Metric: 1608; Resistance: 10kR; Power Rating: 100mW; Voltage Rating: 75V; Temperature Coefficient: 100ppm/°C; Technology: SMT; Power: 0.1 W; Tolerance: 1 %; Supplier 1: Digi-Key; Supplier Part Number 1: 311-0.0GRDKR-ND; Stock 1: 49641653; Pricing 1: 1=0.1, 10=0.021, 25=0.0152, 50=0.0114, 100=0.0084, 250=0.00644, 500=0.00514, 1000=0.00379 (USD); Case/Package: 0603; Number of Pins: 2; Weight: 7.1E-05oz; Case Code (Metric): 1608; Case Code (Imperial): 0603; Contact Plating: Lead,Tin; Min Operating Temperature: -55°C; Max Operating Temperature: 155°C; Packaging: Tape and Reel; Package Quantity: 10; Composition: Thick Film; Military Standard: Not; Termination: SMD/SMT; Voltage Rating (DC): 75V; Number of Terminations: 2; Max Power Dissipation: 100mW; Features: Automotive AEC-Q200; Length: 1.55mm; Height: 0.45mm; Width: 0.033inch; Depth: 0.85mm; Radiation Hardening: No; REACH SVHC: Unknown; Lead Free: Lead Free; ComponentLink1URL: http://www.vishay.com/docs/20008/dcrcw.pdf; ComponentLink1Description: http://www.vishay.com/docs/20008/dcrcw.pdf; ComponentLink2URL: https://www.verical.com/server-webapp/html/getDatasheet?partID=86831; ComponentLink2Description: https://www.verical.com/server-webapp/html/getDatasheet?partID=86831; ComponentLink3URL: http://www.farnell.com/datasheets/2310790.pdf; ComponentLink3Description: http://www.farnell.com/datasheets/2310790.pdf; ComponentLink4URL: http://www.vishay.com/docs/20035/dcrcwe3.pdf; ComponentLink4Description: http://www.vishay.com/docs/20035/dcrcwe3.pdf; ComponentLink5URL: http://www.farnell.com/datasheets/2111203.pdf; ComponentLink5Description: http://www.farnell.com/datasheets/2111203.pdf; ComponentLink6URL: http://uk.rs-online.com/webdocs/0d98/0900766b80d98afc.pdf; ComponentLink6Description: http://uk.rs-online.com/webdocs/0d98/0900766b80d98afc.pdf

## Sheet AD717-2.SchDoc
size Tabloid; Organization: Altium Limited; Address1: L3, 12a Rodborough Rd; Address2: Frenchs Forest; Address3: NSW; Address4: Australia 2086
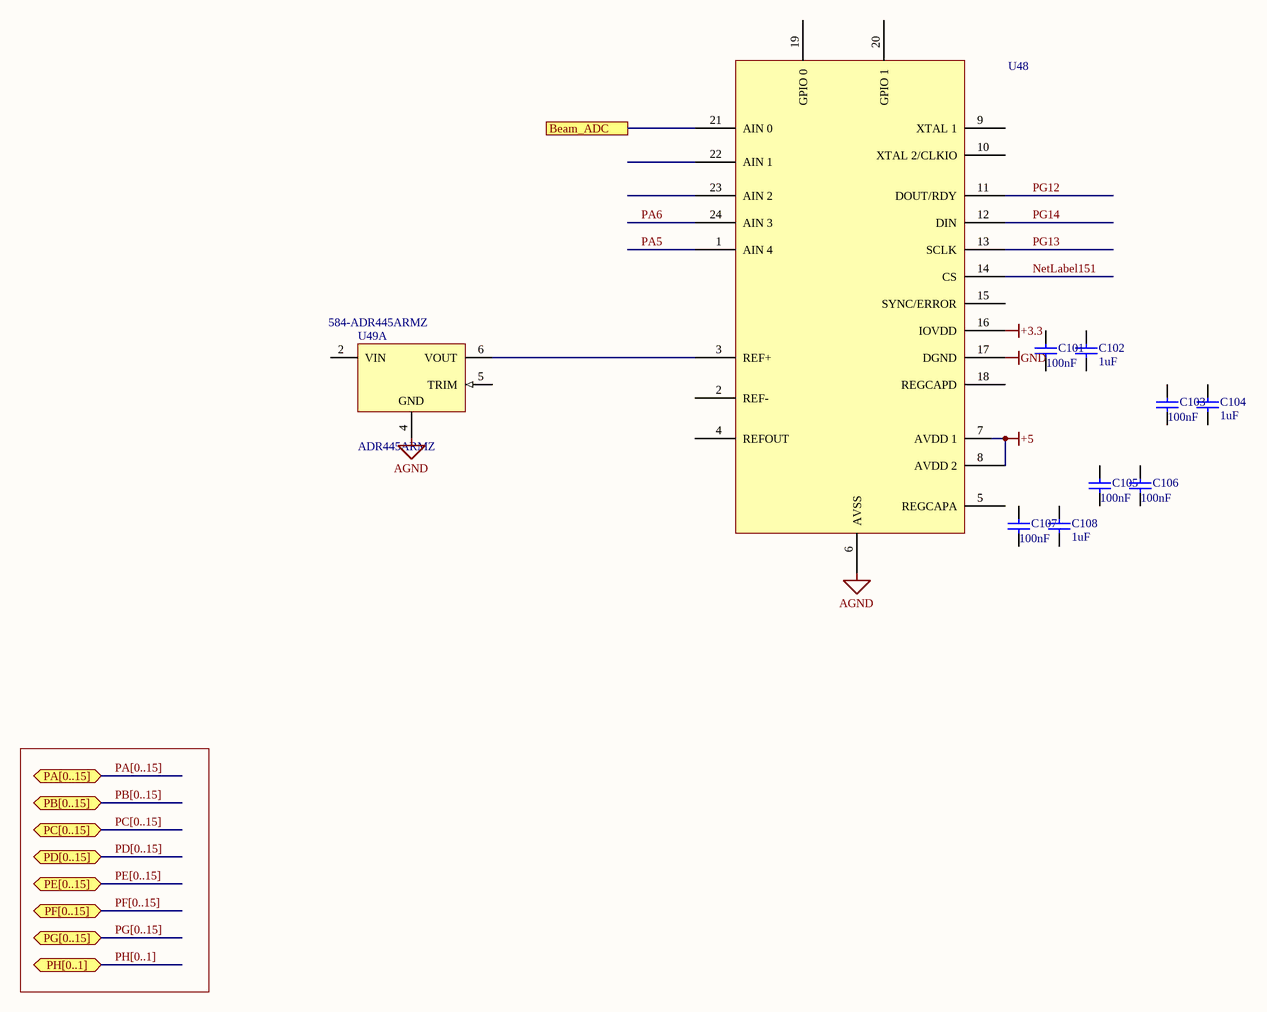
[diagram p15: AD717-2.SchDoc]

### Parts
C101  Capacitance: 100nF  [C0402]  (hidden comment: Capacitor)
C102  value 1uF  [C0603]  (hidden comment: Capacitor)
C103  Capacitance: 100nF  [C0402]  (hidden comment: Capacitor)
C104  value 1uF  [C0603]  (hidden comment: Capacitor)
C105  Capacitance: 100nF  [C0402]  (hidden comment: Capacitor)
C106  Capacitance: 100nF  [C0402]  (hidden comment: Capacitor)
C107  Capacitance: 100nF  [C0402]  (hidden comment: Capacitor)
C108  value 1uF  [C0603]  (hidden comment: Capacitor)
U48  AD7177-2  [AD7177-2BRUZ]  (value not drawn)
U49  ADR445ARMZ  Supplier Part Number 1: 584-ADR445ARMZ  [ADI-RM-8_M]  (part A of 2)

### Ports
Beam_ADC, PA[0..15] (bidir), PB[0..15] (bidir), PC[0..15] (bidir), PD[0..15] (bidir), PE[0..15] (bidir), PF[0..15] (bidir), PG[0..15] (bidir), PH[0..1] (bidir)

### Nets
+3.3: U48.16(IOVDD)
+5: U48.7(AVDD_1) U48.8(AVDD_2)
AGND: U48.6(AVSS) U49.4(GND)
GND: U48.17(DGND)
Beam_ADC: U48.21(AIN_0) ; port Beam_ADC
NetLabel151: U48.14(CS)
PA5: U48.1(AIN_4)
PA6: U48.24(AIN_3)
PG12: U48.11(DOUT/RDY)
PG13: U48.13(SCLK)
PG14: U48.12(DIN)
NetU48_3: U48.3(REF+) U49.6(VOUT)

Not connected (* = marked no-connect by the designer): C101 1 2; C102 1 2; C103 1 2; C104 1 2; C105 1 2; C106 1 2; C107 1 2; C108 1 2; U48 2(REF-) 4(REFOUT) 5(REGCAPA) 9(XTAL_1) 10(XTAL_2/CLKIO) 15(SYNC/ERROR) 18(REGCAPD) 19(GPIO_0) 20(GPIO_1) 22(AIN_1) 23(AIN_2); U49 2(VIN) 5(TRIM)

### Buses and harness runs
bus PA[0..15] = port PA[0..15]
bus PB[0..15] = port PB[0..15]
bus PC[0..15] = port PC[0..15]
bus PD[0..15] = port PD[0..15]
bus PE[0..15] = port PE[0..15]
bus PF[0..15] = port PF[0..15]
bus PG[0..15] = port PG[0..15]
bus PH[0..1] = port PH[0..1]

### Notes on the sheet
- Title
- Size:
- Date:
- Tabloid
- Number:
- Time:
- Revision:
- Sheet
- of
- File:

### Library data of the parts
C101 C103 C105-C107 = MCD-01123: CAP CER 0.1UF 16V X7R 0402; Manufacturer: Yageo; Manufacturer Part Number: CC0402KRX7R7BB104; Tolerance: 10%; Supplier 1: Mouser; Supplier Part Number 1: 603-CC402KRX7R7BB104; Stock 1: 164534511; Pricing 1: 1=0.10000, 10=0.02700, 50=0.02700, 100=0.01200, 1000=0.00700, 2500=0.00600, 10000=0.00500, 20000=0.00400 (USD); RoHS: Yes; Mount: Surface Mount; Case/Package: 0402; Number of Pins: 2; Case Code (Metric): 1005; Case Code (Imperial): 0402; Min Operating Temperature: -55°C; Max Operating Temperature: 125°C; Dielectric: X7R; Voltage Rating: 16V; Voltage Rating (DC): 16V; Packaging: Tape and Reel; Package Quantity: 1; Termination: SMD/SMT; Composition: Ceramic; Voltage: 16V; Length: 1mm; Height: 0.5mm; Width: 0.02inch; Thickness: 0.022inch; Depth: 0.5mm; Radiation Hardening: No; REACH SVHC: No SVHC; Lead Free: Lead Free; Halogen Free: Halogen Free; ComponentLink1URL: https://datasheet.ciiva.com/11788/0900766b80ce67ed-11788364.pdf?src-supplier=RSComponents; ComponentLink1Description: https://datasheet.ciiva.com/11788/0900766b80ce67ed-11788364.pdf?src-supplier=RSComponents; ComponentLink2URL: https://datasheet.ciiva.com/16625/upy-gphc-x7r-6-3v-to-50v-8-16625511.pdf?src-supplier=Avnet+Europe; ComponentLink2Description: https://datasheet.ciiva.com/16625/upy-gphc-x7r-6-3v-to-50v-8-16625511.pdf?src-supplier=Avnet+Europe; ComponentLink3URL: https://datasheet.ciiva.com/161/mlccorderingcode-161544.pdf?src-supplier=Digi-Key; ComponentLink3Description: https://datasheet.ciiva.com/161/mlccorderingcode-161544.pdf?src-supplier=Digi-Key; ComponentLink4URL: https://datasheet.ciiva.com/11587/upy-gphc-x7r-6-3v-to-50v-8-11587305.pdf?src-supplier=Avnet; ComponentLink4Description: https://datasheet.ciiva.com/11587/upy-gphc-x7r-6-3v-to-50v-8-11587305.pdf?src-supplier=Avnet; ComponentLink5URL: https://datasheet.ciiva.com/161/mlccorderingcode-161546.pdf?src-supplier=Digi-Key; ComponentLink5Description: https://datasheet.ciiva.com/161/mlccorderingcode-161546.pdf?src-supplier=Digi-Key; ComponentLink6URL: https://datasheet.ciiva.com/7978/1489800-7978111.pdf?src-supplier=Element14; ComponentLink6Description: https://datasheet.ciiva.com/7978/1489800-7978111.pdf?src-supplier=Element14; ComponentLink7URL: https://datasheet.ciiva.com/161/mlccorderingcode-161545.pdf?src-supplier=Digi-Key; ComponentLink7Description: https://datasheet.ciiva.com/161/mlccorderingcode-161545.pdf?src-supplier=Digi-Key; ComponentLink8URL: https://datasheet.ciiva.com/13395/upy-gphc-x7r-6-3v-to-50v-8-13395676.pdf?src-supplier=Mouser; ComponentLink8Description: https://datasheet.ciiva.com/13395/upy-gphc-x7r-6-3v-to-50v-8-13395676.pdf?src-supplier=Mouser; ComponentLink9URL: https://datasheet.ciiva.com/8033/1734573-8033661.pdf?src-supplier=Element14; ComponentLink9Description: https://datasheet.ciiva.com/8033/1734573-8033661.pdf?src-supplier=Element14; ComponentLink10URL: https://datasheet.ciiva.com/8033/1734573-8033663.pdf?src-supplier=Element14; ComponentLink10Description: https://datasheet.ciiva.com/8033/1734573-8033663.pdf?src-supplier=Element14; ComponentLink11URL: https://datasheet.ciiva.com/28450/1489800-28450335.pdf?src-supplier=Element14; ComponentLink11Description: https://datasheet.ciiva.com/28450/1489800-28450335.pdf?src-supplier=Element14
C102 C104 C108 = MCD-00238: Capacitor, MLCC, 1uF, 6V3, X5R, 10%, 0603, T=0,8mm; Manufacturer_Part_Number: CC0603KRX5R5BB105; Manufacturer: YAGEO; Provided_By: SUBCO; ECCN_US: EAR99; ECCN_EU: NEC; Internal_Part_Number: MCD-00238; ComponentLink1Description: Datasheet; Status: Released; Part_Type: Capacitor; Package: C0603; ComponentLink1URL: http://tunmcdsvn.tun.st.com/Component_Datasheet_Library/Trunk/Capacitors/Yageo_Multilayer_capacitor_X5R_series_100pF_to_100uF
U49 = CMP-0784-00380-1: Ultralow Noise, LDO XFET Voltage Reference with Current Sink and Source, 5 V Output, 5.5 to 18 V Supply, Industrial, 8-pin SOP (RM-8), Tube; Manufacturer: Analog Devices; Min V Supply (V): 5.5; Vout: 5V; Ref Out TC (ppm/C): 2; Max V Supply (V): 18; Max Input Voltage: 20V; Max Output Current: 10mA; Operating Supply Current: 3.75mA; Temperature Coefficient: 10ppm/°C; Reference Type: Series; Tolerance: 0.12%; Output Type: Fixed; Min Input Voltage: 5.5V; ComponentLink2Description: Datasheet; ComponentLink1URL: http://www.analog.com/en/index.html; Packing: Tube; ComponentLink2URL: http://www.analog.com/static/imported-files/data_sheets/ADR440_441_443_444_445.pdf; ComponentLink1Description: Manufacturer URL; Mounting Technology: Surface Mount; DatasheetVersion: Rev. E; PackageReference: RM-8; ComponentLink4URL: Product URL:http://www.analog.com/en/special-linear-functions/voltage-references/adr445/products/product.html; Operating Temp Range: -40 to 125 degC; PackageDescription: 8-Pin Mini Small Outline Package, Body 3 x 3 mm, Pitch 0.65 mm; PackageVersion: Aug-05; Code_JEDEC: MO-187-AA; PartNumber: ADR445ARMZ; ComponentLink3URL: http://www.analog.com/static/imported-files/packages/PKG_PDF/MSOP%28RM%29/RM_8.pdf; ComponentLink3Description: Package Specification; ComponentLink4Description: URL Link1; Supplier 1: Mouser; Manufacturer Part Number: ADR445ARMZ; Stock 1: 815; Pricing 1: 1=6.24000, 10=5.61000, 25=5.28000, 50=4.96000, 100=4.71000, 250=4.43000, 500=4.02000, 1000=3.44000, 2500=3.40000, 10000=3.44000 (USD); RoHS: Yes; Case/Package: MSOP; Number of Pins: 8; Min Operating Temperature: -40°C; Max Operating Temperature: 125°C; Output Voltage: 5V; Packaging: Rail/Tube; Package Quantity: 50; Min Output Voltage: 5V; Output Current: 10mA; Max Output Voltage: 5V; Nominal Supply Current: 3.75mA; Current Rating: 3.75mA; Reference Voltage: 5V; Length: 3mm; Height: 0.85mm; Width: 3mm; Radiation Hardening: No; Lead Free: Contains Lead; REACH SVHC: No SVHC; ComponentLink5URL: https://datasheet.ciiva.com/26887/adr445armz-26887930.pdf?src-supplier=IIIC; ComponentLink5Description: https://datasheet.ciiva.com/26887/adr445armz-26887930.pdf?src-supplier=IIIC; ComponentLink6URL: https://datasheet.ciiva.com/15373/adr440-441-443-444-445-279233-15373198.pdf?src-supplier=Mouser; ComponentLink6Description: https://datasheet.ciiva.com/15373/adr440-441-443-444-445-279233-15373198.pdf?src-supplier=Mouser; ComponentLink7URL: https://datasheet.ciiva.com/2008/adr440-441-443-444-445-2008927.pdf?src-supplier=Digi-Key; ComponentLink7Description: https://datasheet.ciiva.com/2008/adr440-441-443-444-445-2008927.pdf?src-supplier=Digi-Key; ComponentLink8URL: https://datasheet.ciiva.com/1172/1048061-1172739.pdf?src-supplier=Element14; ComponentLink8Description: https://datasheet.ciiva.com/1172/1048061-1172739.pdf?src-supplier=Element14; ComponentLink9URL: https://datasheet.ciiva.com/3235/adr440-441-443-444-445-3235286.pdf?src-supplier=Avnet; ComponentLink9Description: https://datasheet.ciiva.com/3235/adr440-441-443-444-445-3235286.pdf?src-supplier=Avnet; ComponentLink10URL: https://datasheet.ciiva.com/17219/adr440-441-443-444-445-17219117.pdf?src-supplier=Avnet+Europe; ComponentLink10Description: https://datasheet.ciiva.com/17219/adr440-441-443-444-445-17219117.pdf?src-supplier=Avnet+Europe

## Sheet SYS_PWR_ADC.SchDoc
size Tabloid; Organization: Altium Limited; Address1: L3, 12a Rodborough Rd; Address2: Frenchs Forest; Address3: NSW; Address4: Australia 2086
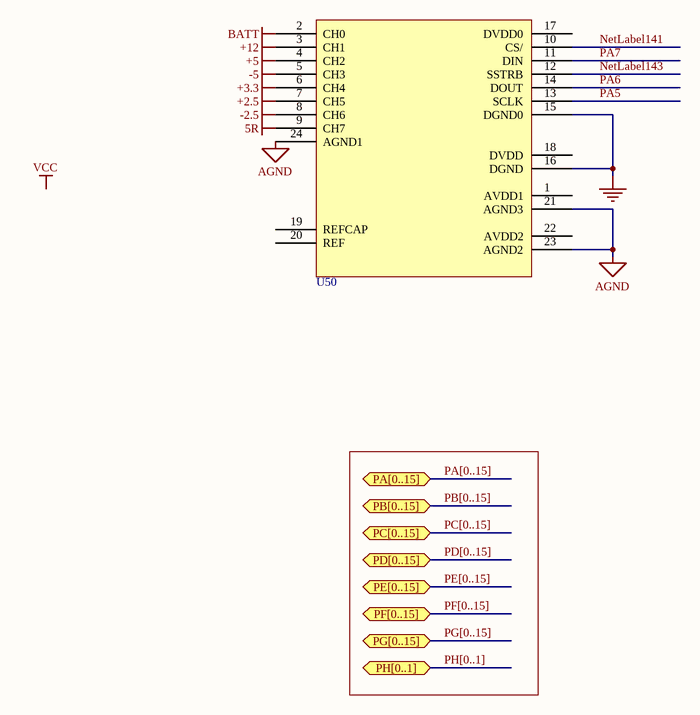
[diagram p16: SYS_PWR_ADC.SchDoc]

### Parts
U50  MAX1300  [MAX1300]  (value not drawn)

### Ports
PA[0..15] (bidir), PB[0..15] (bidir), PC[0..15] (bidir), PD[0..15] (bidir), PE[0..15] (bidir), PF[0..15] (bidir), PG[0..15] (bidir), PH[0..1] (bidir)

### Nets
5R: U50.9(CH7)
+2.5: U50.7(CH5)
+3.3: U50.6(CH4)
+5: U50.4(CH2)
+12: U50.3(CH1)
-2.5: U50.8(CH6)
-5: U50.5(CH3)
AGND: U50.21(AGND3) U50.23(AGND2) U50.24(AGND1)
BATT: U50.2(CH0)
GND: U50.15(DGND0) U50.16(DGND)
NetLabel141: U50.10(CS/)
NetLabel143: U50.12(SSTRB)
PA5: U50.13(SCLK)
PA6: U50.14(DOUT)
PA7: U50.11(DIN)

Not connected (* = marked no-connect by the designer): U50 1(AVDD1) 17(DVDD0) 18(DVDD) 19(REFCAP) 20(REF) 22(AVDD2)

### Buses and harness runs
bus PA[0..15] = port PA[0..15]
bus PB[0..15] = port PB[0..15]
bus PC[0..15] = port PC[0..15]
bus PD[0..15] = port PD[0..15]
bus PE[0..15] = port PE[0..15]
bus PF[0..15] = port PF[0..15]
bus PG[0..15] = port PG[0..15]
bus PH[0..1] = port PH[0..1]

### Notes on the sheet
- Labels drawn without touching a wire or pin: VCC
- Title
- Size:
- Date:
- Tabloid
- Number:
- Time:
- Revision:
- Sheet
- of
- File:

## Nets that join several sheets
3V3: MCU_144_POWER (SB1.1), Power_Board (6 pins), ST_LINK_V3E (CN1.3)
3V3_PER: MCU_144_POWER (SB2.1), Power_Board (SB5.2)
3V3_VDD: MCU_144_IOs (R5.2 U47.95), MCU_144_POWER (SB10.1), Power_Board (JP1.2)
+2.5: Levels (C36.2 U12.5 U13.7 U16.7), SYS_PWR_ADC (U50.7)
+3.3: Heater (U6.1), SynchDemod (U20.5 U23.5 U25.5), Levels (U14.5 U17.5), Bluetooth (6 pins), Power (C73.2 C74.2 U31.1 U31.2), Conning_Tower (U38.5 U39.5), ZPZH (R88.1), Encoder (C92.1 R90.2 U43.2 U44.5), Motors (R97.2 R104.2 R115.2 R122.2), AD717-2 (U48.16), SYS_PWR_ADC (U50.6)
+5: Heater (7 pins), SynchDemod (C49.1 R33.2 U19.5), Levels (9 pins), Power (6 pins), Conning_Tower (C80.2 C82.2 U34.16 U37.8), ZPZH (5 pins), Encoder (P6.3 R91.1 U43.1), Motors (12 pins), AD717-2 (U48.7 U48.8), SYS_PWR_ADC (U50.4)
+5R: SynchDemod (U18.4 U18.9 U22.11), ZPZH (U40.1 U40.4)
+12: Heater (10 pins), SynchDemod (5 pins), 12V_Supply (22 pins), Force_Plates_Power_Supply (C64.2 U27.3), ZPZH (C87.1 U40.5), SYS_PWR_ADC (U50.3)
-2.5: Levels (C42.2 U13.1 U15.5 U16.1), SYS_PWR_ADC (U50.8)
-5: SynchDemod (C51.1 C53.1 U18.5 U19.2), Levels (5 pins), Power (C75.2 U32.2), Conning_Tower (C85.2 U37.4), SYS_PWR_ADC (U50.5)
AGND: MCU_144_IOs (U47.31), MCU_144_POWER (5 pins), SynchDemod (7 pins), ZPZH (8 pins), AD717-2 (U48.6 U49.4), SYS_PWR_ADC (U50.21 U50.23 U50.24)
GND: MCU_144_IOs (21 pins), MCU_144_POWER (13 pins), Power_Board (C1.1 C2.1 LD1.2 U1.1), ST_LINK_V3E (5 pins), Heater (33 pins), SynchDemod (19 pins), Levels (38 pins), 12V_Supply (87 pins), Bluetooth (P2.J2-1 P2.J2-2), Power (12 pins), Force_Plates_Power_Supply (6 pins), Conning_Tower (32 pins), ZPZH (U42.1 U42.6), Encoder (10 pins), Motors (44 pins), AD717-2 (U48.17), SYS_PWR_ADC (U50.15 U50.16)
Power_IN: Power_Board (C1.2 U1.3), 12V_Supply (16 pins), Power (6 pins)
VDD_MCU: MCU_144_IOs (14 pins), MCU_144_POWER (13 pins)
VDDA: MCU_144_IOs (C9.2 R9.1 R10.1 U47.33), MCU_144_POWER (C14.1 C15.2)
VREFP: MCU_144_IOs (R10.2 U47.32), MCU_144_POWER (C16.1 C17.2)
ZSupply: Force_Plates_Power_Supply (C65.2 U27.2), Conning_Tower (6 pins)
BEAM: SynchDemod (U18.14), Conning_Tower (C83.2 R81.1)
Beam_ADC: SynchDemod (R113.1), AD717-2 (U48.21)
Bottom In: Conning_Tower (U34.12), ZPZH (U42.4)
Bottom Sense Plate Force: SynchDemod (R54.1 R56.2), Conning_Tower (J1.7)
Bottom Sense Plate Sense: SynchDemod (U24.3), Conning_Tower (J1.8)
PA5: MCU_144_IOs (U47.41), SynchDemod (U23.1 U23.4), AD717-2 (U48.1), SYS_PWR_ADC (U50.13)
PA6: MCU_144_IOs (U47.42), SynchDemod (U25.1 U25.4), AD717-2 (U48.24), SYS_PWR_ADC (U50.14)
PA7: MCU_144_IOs (U47.43), SYS_PWR_ADC (U50.11)
PA15: MCU_144_IOs (U47.110), ST_LINK_V3E (CN1.10 U3.1)
PB10: MCU_144_IOs (U47.69), SynchDemod (U22.2)
PB12: MCU_144_IOs (U47.73), Bluetooth (R66.2)
PB13: MCU_144_IOs (U47.74), Bluetooth (R67.2)
PE2: MCU_144_IOs (U47.1), Encoder (U43.6)
PE5: MCU_144_IOs (U47.4), Encoder (R94.2 U44.6)
PF11: MCU_144_IOs (U47.49), SynchDemod (R105.1)
PG12: MCU_144_IOs (U47.127), AD717-2 (U48.11)
PG13: MCU_144_IOs (U47.128), AD717-2 (U48.13)
PG14: MCU_144_IOs (U47.129), AD717-2 (U48.12)
T_VCP_RX: MCU_144_IOs (U47.78 U47.137), ST_LINK_V3E (CN1.13 U4.1)
T_VCP_TX: MCU_144_IOs (U47.77 U47.136), ST_LINK_V3E (CN1.14 U4.3)
Top In: Conning_Tower (U34.17), ZPZH (U42.11)
Top Sense Plate Force: SynchDemod (R43.1 R45.2), Conning_Tower (J1.5)
Top Sense Plate Sense: SynchDemod (U21.3), Conning_Tower (J1.6)

## Assembly variants
H743ZI: not fitted C62 C63 C69 C70 C71 C72 CN2 CN11 CN12 R35 R54 R55 R67 SB3 SB4 SB5 SB7 SB9 SB10 SB14 SB15 SB16 SB17 SB18 SB20 SB33 SB34 SB37 SB40 SB41 SB44 SB46 SB47 SB49 SB50 SB55 SB58 SB61 SB62 SB65 SB66 SB69 SB70 SB78 SB79 X3
H7A3ZI: not fitted C62 C63 C69 C70 C71 C72 C73 C74 C75 C76 C77 C78 C79 C80 C81 C82 C83 C85 CN2 CN11 CN12 CN14 HW3 JP6 L1 R35 R40 R41 R42 R43 R44 R45 R46 R47 R48 R49 R50 R51 R52 R53 R54 R55 R57 R58 R59 R67 R75 R76 R77 R78 SB3 SB4 SB5 SB7 SB9 SB10 SB14 SB15 SB16 SB17 SB18 SB20 SB27 SB29 SB30 SB31 SB34 SB35 SB36 SB38 SB40 SB41 SB44 SB46 SB47 SB48 SB54 SB55 SB57 SB58 SB60 SB61 SB62 SB64 SB66 SB69 SB70 SB72 SB74 SB78 SB79 U15 U16 U17 X3 X4
H7B3ZI: not fitted C62 C63 C69 C70 C71 C72 C73 C74 C75 C76 C77 C78 C79 C80 C81 C82 C83 C85 CN2 CN11 CN12 CN14 HW3 JP6 L1 R35 R40 R41 R42 R43 R44 R45 R46 R47 R48 R49 R50 R51 R52 R53 R54 R55 R57 R58 R59 R67 R75 R76 R77 R78 SB3 SB4 SB5 SB7 SB9 SB10 SB14 SB15 SB16 SB17 SB18 SB20 SB27 SB29 SB30 SB31 SB34 SB35 SB36 SB38 SB40 SB41 SB44 SB46 SB47 SB48 SB54 SB55 SB57 SB58 SB60 SB61 SB62 SB64 SB66 SB69 SB70 SB72 SB74 SB78 SB79 U15 U16 U17 X3 X4
H753ZI: not fitted C62 C63 C69 C70 C71 C72 CN2 CN11 CN12 R35 R54 R55 R67 SB3 SB4 SB5 SB7 SB9 SB10 SB14 SB15 SB16 SB17 SB18 SB20 SB33 SB34 SB37 SB40 SB41 SB44 SB46 SB47 SB49 SB50 SB55 SB58 SB61 SB62 SB65 SB66 SB69 SB70 SB78 SB79 X3